# EAGLE design mymote-relay (EAGLE 8.2.1)
PROJECT_AUTHOR: TINKERMAN <xose.perez@gmail.com>; PROJECT_LICENSE: CC-SA-BY 3.0; PROJECT_NAME: MYMOTE RELAY; PROJECT_VERSION: 0.2.20170805
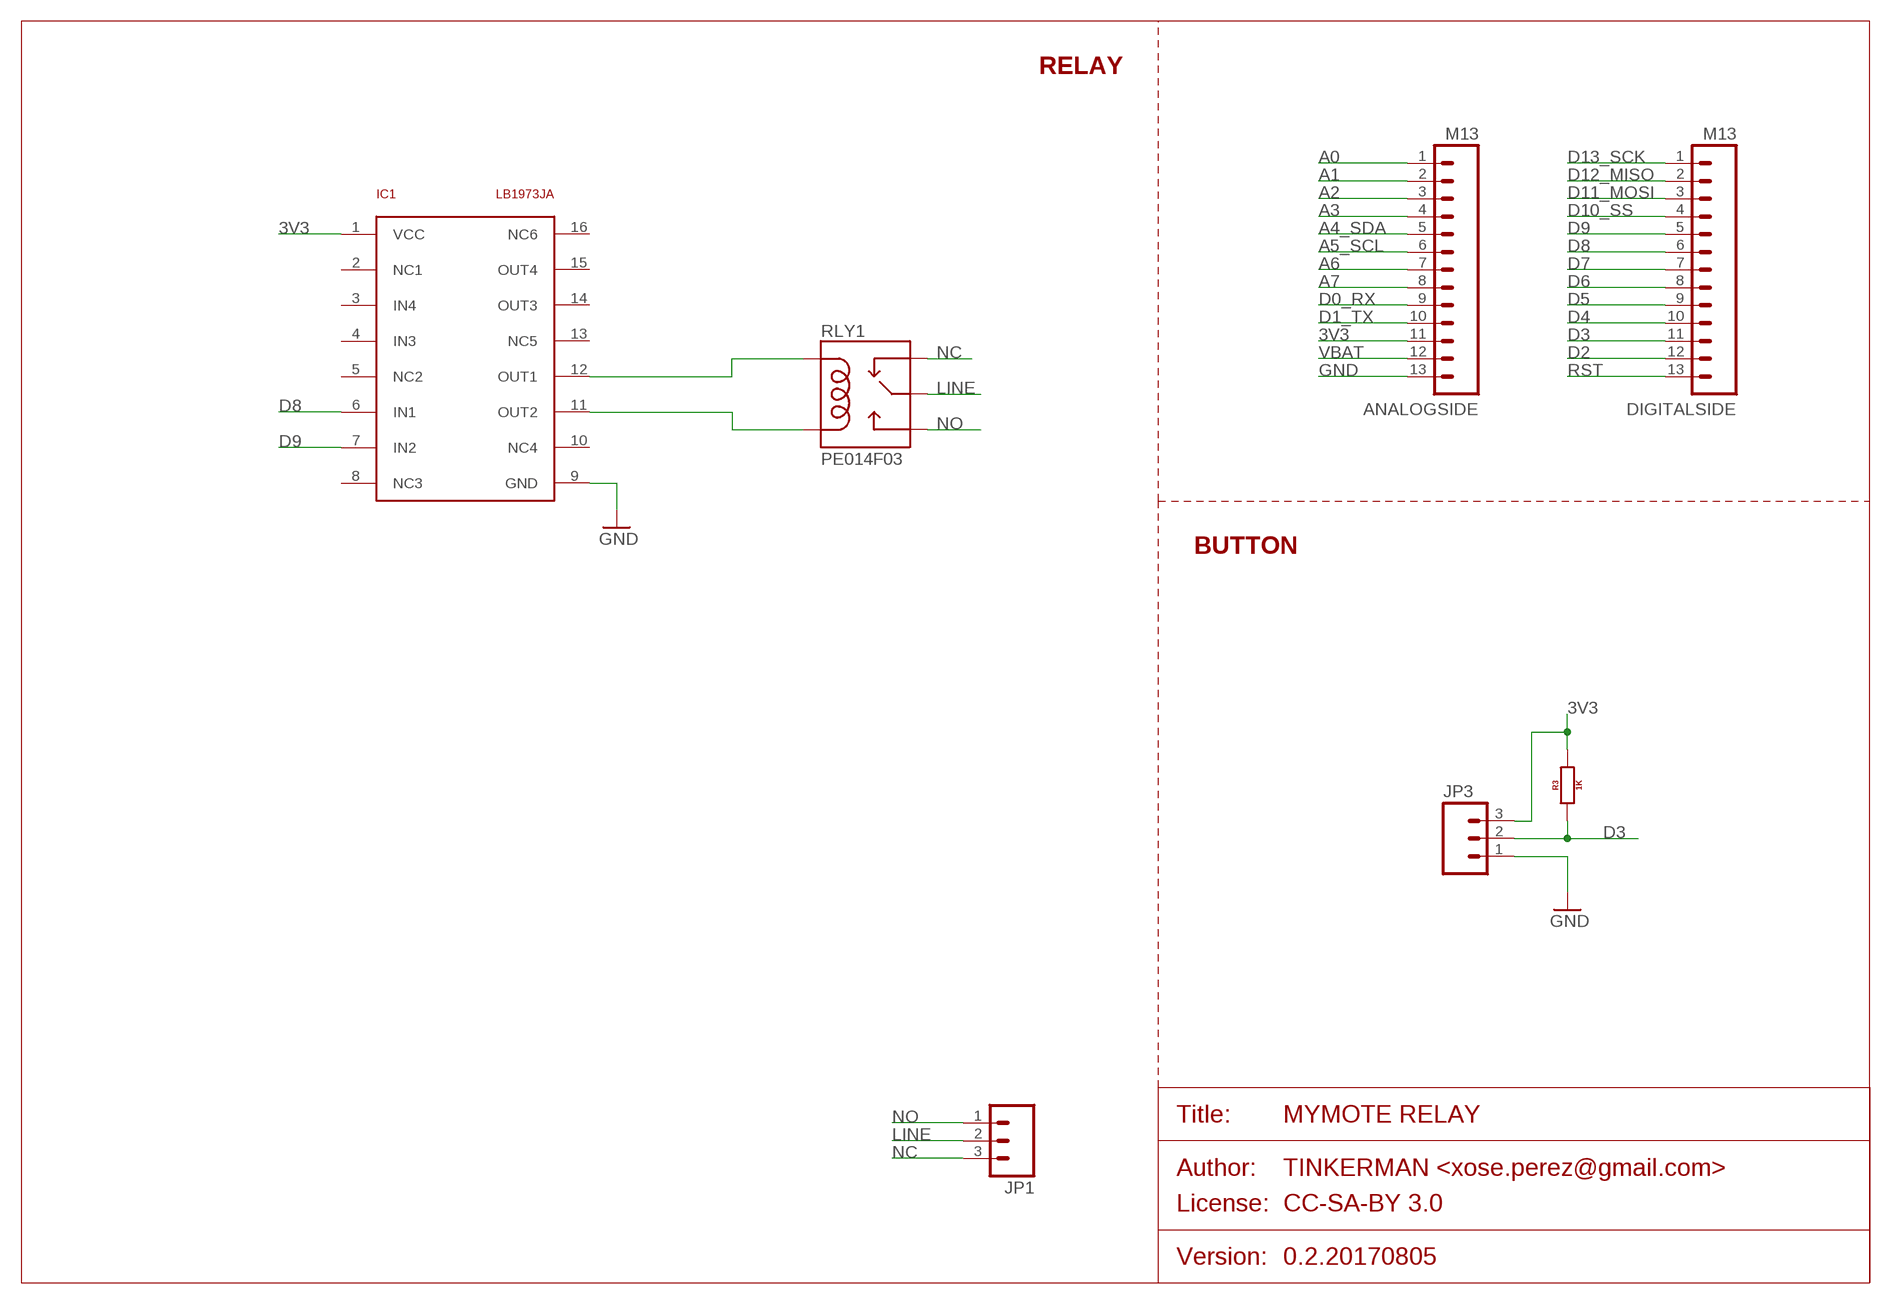
[diagram p0: schematic, sheet 1]

## Parts
ANALOGSIDE  M13  [1X13_NO_SILK]
DIGITALSIDE  M13  [1X13_NO_SILK]
IC1  LB1973JA  [SSOP16]
JP1  M03200MIL  [SCREWTERMINAL-200MIL-3]
JP3  M03JST-PTH-VERT  [JST-3-PTH-VERT]
R3  1K  RESISTOR0805  [0805]
RLY1  PE014F03  RELAYPE014FXX  [PE014F0XX]

## Nets
3V3: ANALOGSIDE.11 IC1.1(VCC) JP3.3 R3.2
A0: ANALOGSIDE.1
A1: ANALOGSIDE.2
A2: ANALOGSIDE.3
A3: ANALOGSIDE.4
A4_SDA: ANALOGSIDE.5
A5_SCL: ANALOGSIDE.6
A6: ANALOGSIDE.7
A7: ANALOGSIDE.8
D0_RX: ANALOGSIDE.9
D1_TX: ANALOGSIDE.10
D2: DIGITALSIDE.12
D3: DIGITALSIDE.11 JP3.2 R3.1
D4: DIGITALSIDE.10
D5: DIGITALSIDE.9
D6: DIGITALSIDE.8
D7: DIGITALSIDE.7
D8: DIGITALSIDE.6 IC1.6(IN1)
D9: DIGITALSIDE.5 IC1.7(IN2)
D10_SS: DIGITALSIDE.4
D11_MOSI: DIGITALSIDE.3
D12_MISO: DIGITALSIDE.2
D13_SCK: DIGITALSIDE.1
GND [power]: ANALOGSIDE.13 IC1.9(GND) JP3.1
LINE: JP1.2 RLY1.COMMON(MAIN)
N$2: IC1.12(OUT1) RLY1.COIL1
N$3: IC1.11(OUT2) RLY1.COIL2
NC: JP1.3 RLY1.CLOSED(NC)
NO: JP1.1 RLY1.OPEN(NO)
RST: DIGITALSIDE.13
VBAT: ANALOGSIDE.12
Unconnected: IC1.2(NC1) IC1.3(IN4) IC1.4(IN3) IC1.5(NC2) IC1.8(NC3) IC1.10(NC4) IC1.13(NC5) IC1.14(OUT3) IC1.15(OUT4) IC1.16(NC6)

## Notes on the sheet
- RELAY
- BUTTON

## Library data of the parts
ANALOGSIDE DIGITALSIDE = xose:M13
IC1 = xose:LB1973JA
JP1 JP3 = xose:M03: Header 3 Standard 3-pin 0.1" header. Use with straight break away headers (SKU : PRT-00116), right angle break away headers (PRT-00553), swiss pins (PRT-00743), machine pins (PRT-00117), and female headers (PRT-00115). Molex polarized connector foot print use with SKU : PRT-08232 with associated crimp pins and housings.
R3 = xose:RESISTOR: Generic EU resistor symbol
RLY1 = xose:RELAY: Relay

## Net classes
1 power: width 0.381 mm, clearance 0.254 mm

## Board
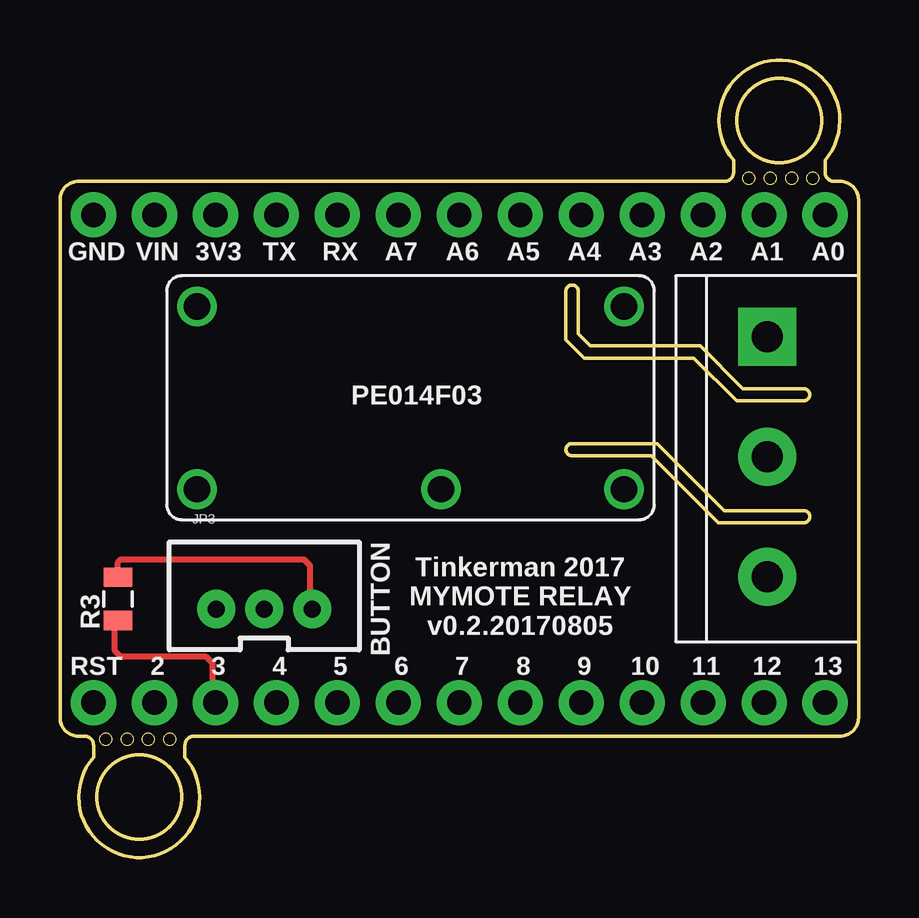
[diagram p1: board, top side]
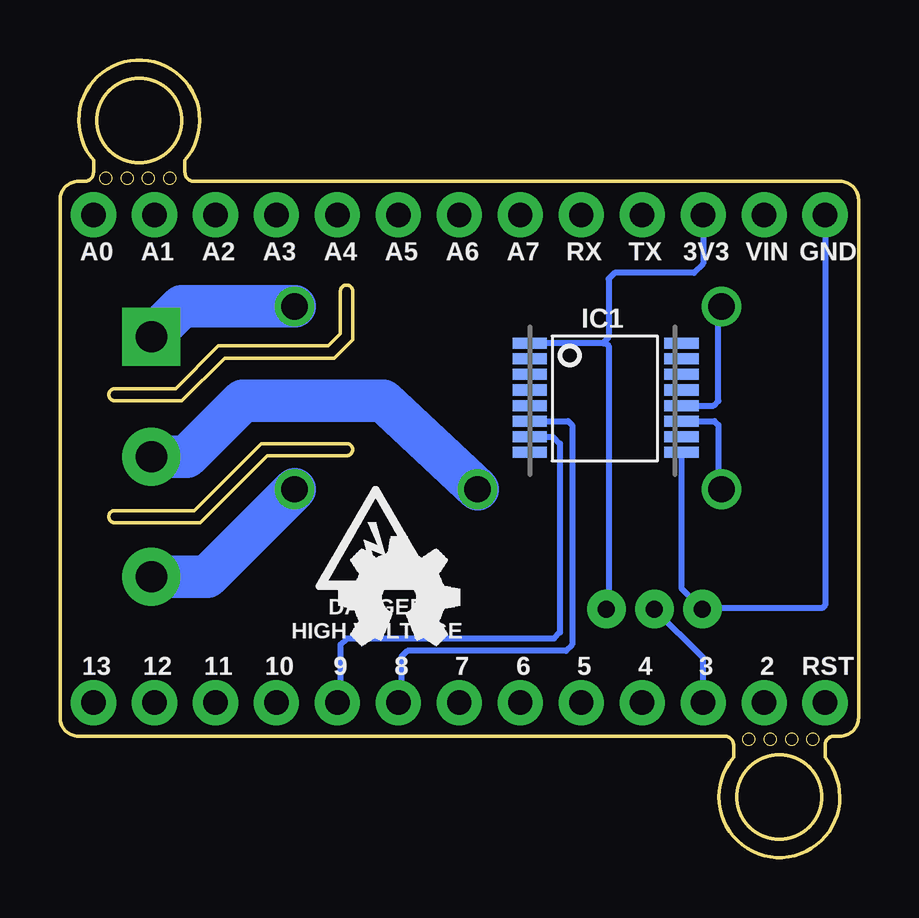
[diagram p2: board, bottom side, seen from below]

Size 33.27 x 33.23 mm. Coordinates in mm from the lower left corner, seen from the top.
Outline: 0.71,5.06 0.76,5.06
Outline: 0.76,28.17 0.71,28.17
Outline: 0,5.77 0,5.82
Outline: 0,27.41 0,27.46
Outline: 0,5.82 0,27.41
Outline: 0,27.41 arc-90 0.76,28.17
Outline: 0.76,5.06 1.02,5.06 arc-90 1.4,4.68 1.4,4.17 arc262 5.21,4.17 5.21,4.68 arc-90 5.59,5.06 32.51,5.06 arc90 33.27,5.82 33.27,27.41 arc90 32.51,28.17 32.26,28.17 arc-90 31.88,28.55 31.88,29.06 arc262 28.07,29.06 28.07,28.55 arc-90 27.69,28.17 0.76,28.17
Outline: 0.76,5.06 arc-90 0,5.82
Outline: 30.99,19.54 28.45,19.54 26.67,21.31 22.1,21.31 21.59,21.82 21.59,23.6 arc90 21.34,23.85 arc90 21.08,23.6 21.08,21.57 21.84,20.81 26.42,20.81 28.19,19.03 30.99,19.03 arc90 31.24,19.28 arc90 30.99,19.54
Outline: 30.99,13.95 arc90 31.24,14.2 arc90 30.99,14.46 27.69,14.46 24.89,17.25 21.34,17.25 arc90 21.08,17 arc90 21.34,16.74 24.64,16.74 27.43,13.95 30.99,13.95
Outline: circle at 3.3,2.52 radius 1.75
Outline: circle at 1.91,4.93 radius 0.25
Outline: circle at 2.79,4.93 radius 0.25
Outline: circle at 3.68,4.93 radius 0.25
Outline: circle at 29.97,30.71 radius 1.75
Outline: circle at 31.37,28.3 radius 0.25
Outline: circle at 30.48,28.3 radius 0.25
Outline: circle at 29.59,28.3 radius 0.25
Outline: circle at 4.57,4.93 radius 0.25
Outline: circle at 28.7,28.3 radius 0.25
Copper layers (1*16): Top 0.0356mm / dielectric 1.5011mm / Bottom 0.0356mm
Design rules "oshpark-2layer": minimum track width 6mil, minimum drill 13mil, track to track 6mil, track to pad 6mil, pad to pad 6mil, via to via 6mil, smd to smd 6mil, copper to edge 15mil, drill to drill 6mil, minimum pad ring 7mil, minimum via ring 7mil, stop-mask expansion 2.5mil, vias tented up to drill 0mil, thermal gap 10mil

### Footprints (pad centres in the part's own frame; a part is rotated, then mirrored left to right if it is on the bottom)
1X13_NO_SILK = drill 1.016 pad 1.88: 1 0,0; 2 2.54,0; 3 5.08,0; 4 7.62,0; 5 10.16,0; 6 12.7,0; 7 15.24,0; 8 17.78,0; 9 20.32,0; 10 22.86,0; 11 25.4,0; 12 27.94,0; 13 30.48,0
SSOP16 = smd 0.46 x 1.43: 1 -2.402,-3.033; 2 -1.752,-3.033; 3 -1.102,-3.033; 4 -0.452,-3.033; 5 0.198,-3.033; 6 0.848,-3.033; 7 1.498,-3.033; 8 2.148,-3.033; 9 2.148,3.287; 10 1.498,3.287; 11 0.848,3.287; 12 0.198,3.287; 13 -0.452,3.287; 14 -1.102,3.287; 15 -1.752,3.287; 16 -2.402,3.287
SCREWTERMINAL-200MIL-3 = drill 1.3 pad 2.413 square: 1 0,0 | drill 1.3 pad 2.413: 2 5,0; 3 10,0
JST-3-PTH-VERT = drill 0.7 pad 1.6: 1 -2,-0.55; 2 0,-0.55; 3 2,-0.55
0805 = smd 0.8 x 1.2: 1 -0.9,0; 2 0.9,0
PE014F0XX = drill 1.1: CLOSED 19.05,1.27; COIL1 1.27,8.89; COIL2 1.27,1.27; COMMON 11.43,1.27; OPEN 19.05,8.89

### Placement (x,y rotation side)
ANALOGSIDE  31.88,26.77 180 top
DIGITALSIDE  31.88,6.45 180 top
IC1  10.67,19.03 270 bottom
JP1  29.46,21.69 270 top
JP3  8.51,10.9 0 top
R3  2.41,10.77 90 top
RLY1  4.45,14.07 0 top

### Tracks (layer width: path | path; a pad name or v marks a point on that pad's centre or on a via)
3V3
  Top 0.254: JP3.3 10.41,10.44 10.41,12.17 10.16,12.42 2.54,12.42 2.41,12.3 R3.2
  Bottom 0.254: 10.67,21.43 IC1.1 | 10.67,21.43 10.53,21.43 10.41,21.31 10.41,10.44 JP3.3 | ANALOGSIDE.11 6.48,24.74 6.86,24.36 10.16,24.36 10.41,24.11 10.41,21.68 10.67,21.43
D3
  Top 0.254: DIGITALSIDE.11 6.35,6.58 6.35,8.11 6.1,8.36 2.54,8.36 2.29,8.61 2.29,9.75 R3.1
  Bottom 0.254: DIGITALSIDE.11 6.48,8.32 JP3.2
D8
  Bottom 0.254: IC1.6 12.11,18.18 11.94,18.01 11.94,8.87 12.19,8.61 18.8,8.61 19.05,8.36 19.05,6.58 DIGITALSIDE.6
D9
  Bottom 0.254: IC1.7 12.73,17.53 12.45,17.25 12.45,9.38 12.7,9.12 21.34,9.12 21.59,8.87 21.59,6.58 DIGITALSIDE.5
GND
  Bottom 0.254: ANALOGSIDE.13 1.4,10.52 1.52,10.39 6.47,10.39 JP3.1 7.38,11.22 IC1.9
LINE
  Bottom 1.778: JP1.2 27.99,16.69 25.65,19.03 19.81,19.03 RLY1.COMMON
N$2
  Bottom 0.254: IC1.12 6.04,18.83 5.84,19.03 5.84,22.84 RLY1.COIL1
N$3
  Bottom 0.254: IC1.11 6.01,18.18 5.84,18.01 5.84,15.47 RLY1.COIL2
NC
  Bottom 1.778: JP1.3 27.14,11.69 RLY1.CLOSED
NO
  Bottom 1.778: RLY1.OPEN 28.19,22.96 JP1.1

### Text on the board
tNames: GND | VIN | 3V3 | TX | RX | A7 | A6 | A5 | A4 | A3 | A2 | A1 | A0 | PE014F03 | BUTTON | Tinkerman 2017 / MYMOTE RELAY / v0.2.20170805 | RST | 2 | 3 | 4 | 5 | 6 | 7 | 8 | 9 | 10 | 11 | 12 | 13
bNames: GND | VIN | 3V3 | TX | RX | A7 | A6 | A5 | A4 | A3 | A2 | A1 | A0 | DANGER / HIGH VOLTAGE | RST | 2 | 3 | 4 | 5 | 6 | 7 | 8 | 9 | 10 | 11 | 12 | 13